# EAGLE design board (EAGLE 7.4.0)
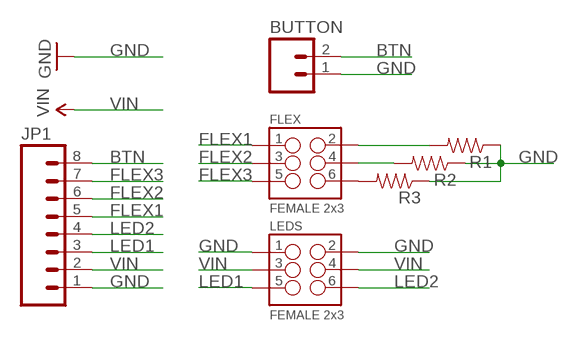
[diagram p0: schematic, sheet 1]

## Parts
BUTTON  M02PTH  [1X02]
FLEX  FEMALE 2x3  M03X2FEMALE  [2X3]
JP1  M08NO_SILK_FEMALE_PTH  [1X08_NO_SILK]
LEDS  FEMALE 2x3  M03X2FEMALE  [2X3]
R1  RESISTORPTH-1/4W  [AXIAL-0.4]
R2  RESISTORPTH-1/4W  [AXIAL-0.4]
R3  RESISTORPTH-1/4W  [AXIAL-0.4]

## Nets
BTN: BUTTON.2 JP1.8
FLEX1: FLEX.1 JP1.5
FLEX2: FLEX.3 JP1.6
FLEX3: FLEX.5 JP1.7
GND: BUTTON.1 JP1.1 LEDS.1 LEDS.2 R1.P$1 R2.P$1 R3.P$1
LED1: JP1.3 LEDS.5
LED2: JP1.4 LEDS.6
R1: FLEX.2 R1.P$2
R2: FLEX.4 R2.P$2
R3: FLEX.6 R3.P$2
VIN: JP1.2 LEDS.3 LEDS.4

## Library data of the parts
BUTTON = SparkFun-Connectors:M02: Standard 2-pin 0.1" header. Use with - straight break away headers ( PRT-00116) - right angle break away headers (PRT-00553) - swiss pins (PRT-00743) - machine pins (PRT-00117) - female headers (PRT-00115) Molex polarized connector foot print use with: PRT-08233 with associated crimp pins and housings. 2.54_SCREWTERM for use with PRT-10571. 3.5mm Screw Terminal footprints for PRT-08084 5mm Screw Terminal footprints for use with PRT-08432
FLEX LEDS = SparkFun-Connectors:M03X2: 2x3 .1" header. Shrouded, with keying- CONN-10681 SMT- CONN-11415 Pogo pins- HW-11044; PROD_ID: CONN-11566
JP1 = SparkFun-Connectors:M08: Header 8 Standard 8-pin 0.1" header. Use with straight break away headers (SKU : PRT-00116), right angle break away headers (PRT-00553), swiss pins (PRT-00743), machine pins (PRT-00117), and female headers (PRT-00115).; PROD_ID: CONN-08438
R1-R3 = SparkFun-Passives:RESISTOR: Resistor Basic schematic elements and footprints for 0603, 1206, and PTH resistors.

## Board
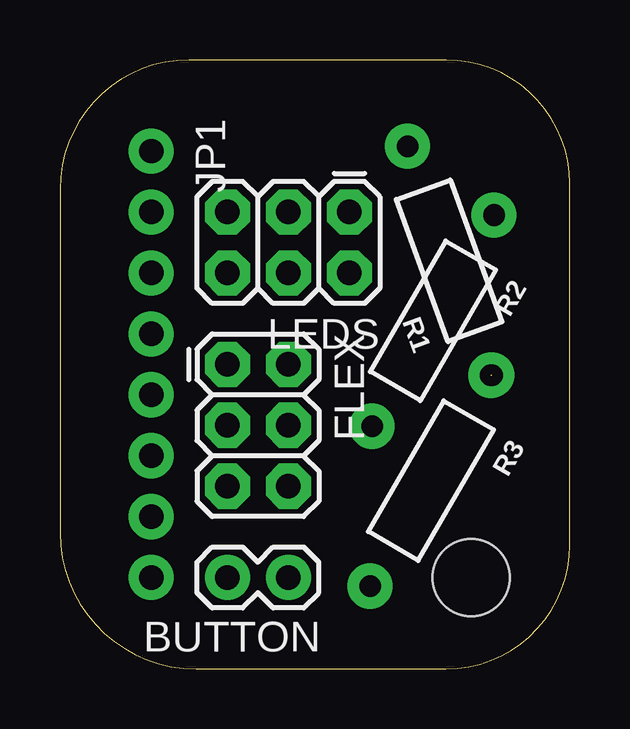
[diagram p1: board, top side]
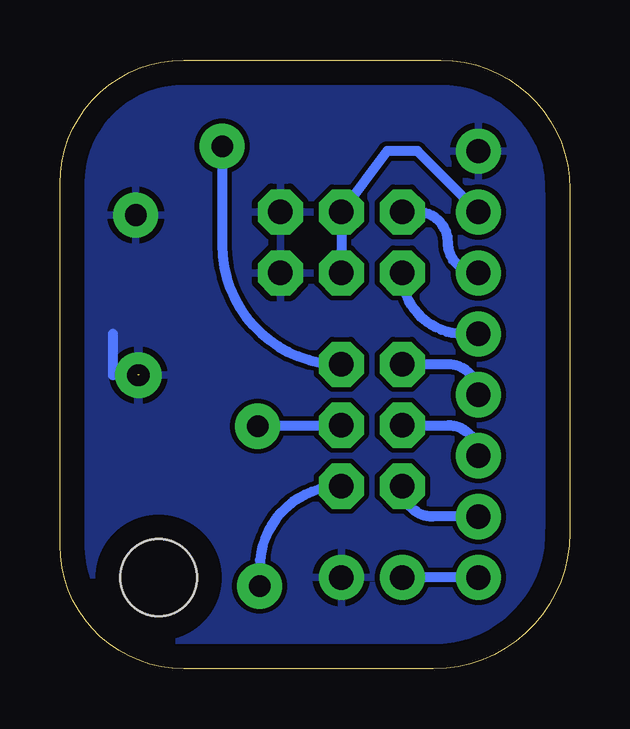
[diagram p2: board, bottom side, seen from below]

Size 21.26 x 25.39 mm. Coordinates in mm from the lower left corner, seen from the top.
Outline: 16.11,25.39 5.38,25.39 arc90 0,20.01 0,5.68 arc90 5.68,0 16.1,0 arc90 21.26,5.16 21.26,20.24 arc90 16.11,25.39
Copper layers (1*16): Top 0.035mm / dielectric 1.5mm / Bottom 0.035mm
Design rules "default": minimum track width 10mil, minimum drill 24mil, track to track 8mil, track to pad 8mil, pad to pad 8mil, via to via 8mil, smd to smd 8mil, copper to edge 40mil, drill to drill 8mil, minimum pad ring 10mil, minimum via ring 8mil, stop-mask expansion 4mil, vias tented up to drill 0mil, thermal gap 10mil
Holes 3.2 mm at 17.14,3.81

### Footprints (pad centres in the part's own frame; a part is rotated, then mirrored left to right if it is on the bottom)
1X02 = drill 1.016 pad 1.88: 1 0,0; 2 2.54,0
2X3 = drill 1.016 pad 1.88 octagon: 1 0,0; 2 0,2.54; 3 2.54,0; 4 2.54,2.54; 5 5.08,0; 6 5.08,2.54
1X08_NO_SILK = drill 1.016 pad 1.88: 1 0,0; 2 2.54,0; 3 5.08,0; 4 7.62,0; 5 10.16,0; 6 12.7,0; 7 15.24,0; 8 17.78,0
AXIAL-0.4 = drill 0.9 pad 1.88: P$1 -5.08,0; P$2 5.08,0

### Placement (x,y rotation side)
BUTTON  9.53,3.81 180 top
FLEX  6.98,12.7 270 top
JP1  3.81,21.59 270 top
LEDS  12.07,19.05 180 top
R1  16.23,17.02 110 top
R2  15.56,14.52 240 top
R3  15.47,7.85 240 top

### Tracks (layer width: path | path; a pad name or v marks a point on that pad's centre or on a via)
BTN
  Bottom 0.406: JP1.8 BUTTON.2
FLEX1
  Bottom 0.406: JP1.5 arc-90 5.08,12.7 FLEX.1
FLEX2
  Bottom 0.406: FLEX.3 5.08,10.16 arc90 JP1.6
FLEX3
  Bottom 0.406: JP1.7 5.71,6.35 arc90 FLEX.5
GND  (1 unrouted)
  Bottom 0.406: R1.P$1 19.05,12.24 19.05,13.97
  pour Bottom: -1.27,0 -1.27,26.67 22.86,26.67 22.86,0
LED1
  Bottom 0.406: JP1.3 arc90 5.08,17.78 arc-90 6.35,19.05 LEDS.5
LED2
  Bottom 0.406: JP1.4 4.45,13.97 arc90 LEDS.6
R1
  Bottom 0.406: R1.P$2 14.49,17.67 arc-90 FLEX.2
R2
  Bottom 0.406: FLEX.4 arc90 9.56,10.12 R2.P$2
R3
  Bottom 0.406: FLEX.6 arc-90 12.93,4.21 R3.P$2
VIN
  Bottom 0.406: JP1.2 6.35,21.59 7.62,21.59 LEDS.3 LEDS.4